# EAGLE design hr20 (EAGLE 6.6.0)
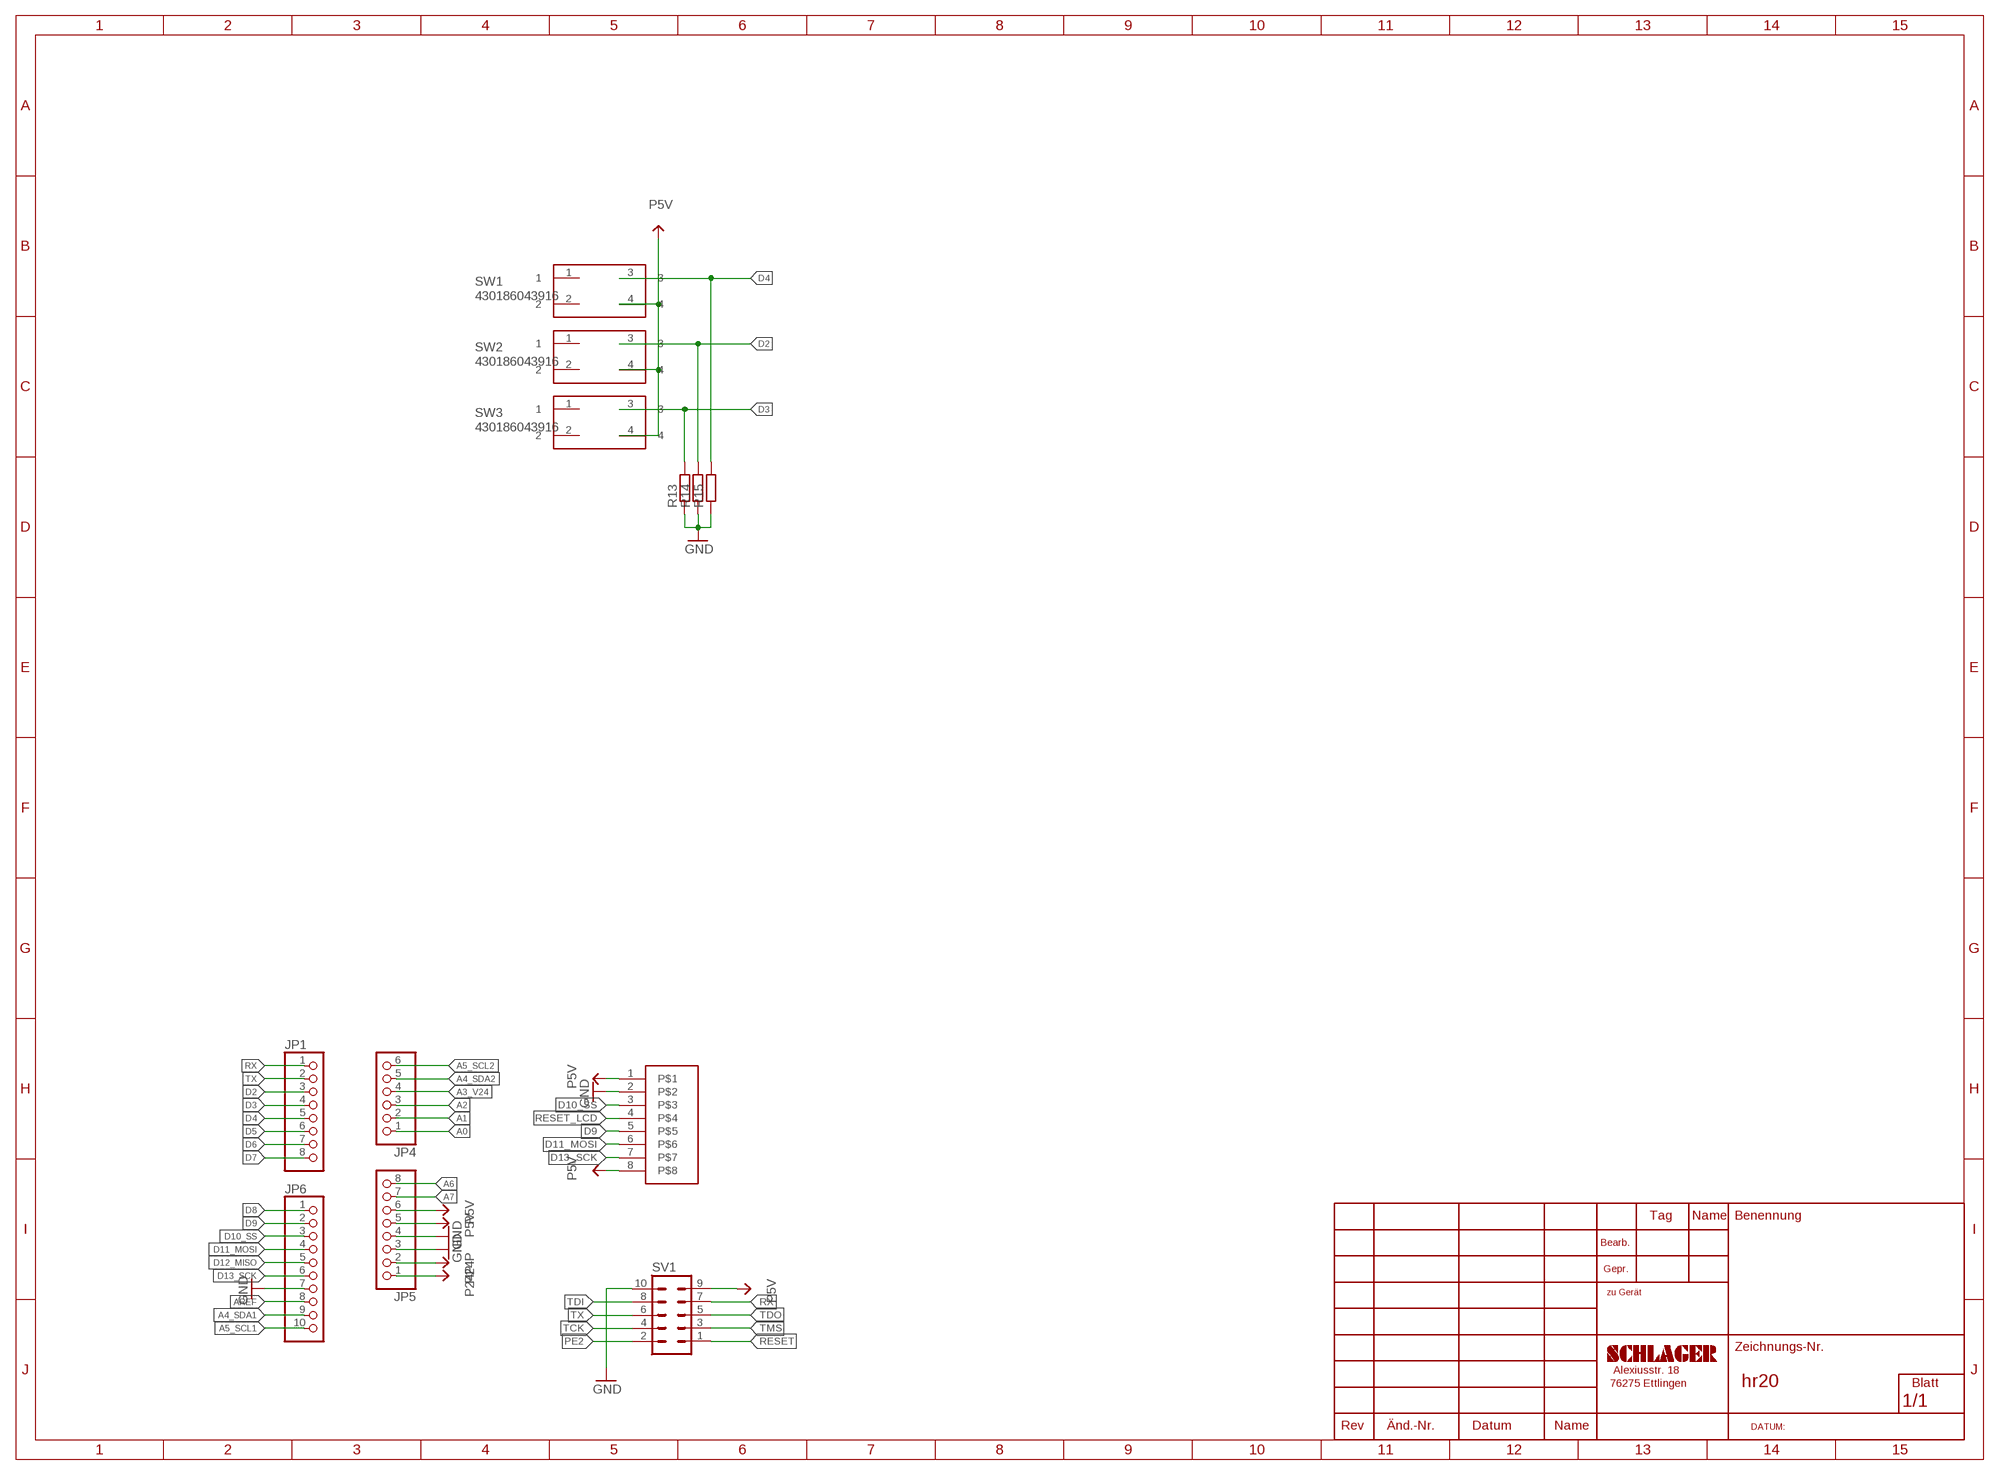
[diagram p0: schematic, sheet 1]

## Parts
JP1  PINHD-1X8  [1X08]
JP4  PINHD-1X6  [1X06]
JP5  PINHD-1X8  [1X08]
JP6  PINHD-1X10  [1X10]
R13  R-EU_0207/10  [0207/10]
R14  R-EU_0207/10  [0207/10]
R15  R-EU_0207/10  [0207/10]
SV1  ML10  [ML10]
SW1  430186043916  [430186043916]
SW2  430186043916  [430186043916]
SW3  430186043916  [430186043916]
U$2  1.44-128X128  [1.44-128X128]

## Nets
A0: JP4.1
A1: JP4.2
A2: JP4.3
A3_V24: JP4.4
A4_SDA1: JP6.9
A4_SDA2: JP4.5
A5_SCL1: JP6.10
A5_SCL2: JP4.6
A6: JP5.8
A7: JP5.7
AREF: JP6.8
D2: JP1.3 R14.2 SW2.3
D3: JP1.4 R13.2 SW3.3
D4: JP1.5 R15.2 SW1.3
D5: JP1.6
D6: JP1.7
D7: JP1.8
D8: JP6.1
D9: JP6.2 U$2.5
D10_SS: JP6.3 U$2.3
D11_MOSI: JP6.4 U$2.6
D12_MISO: JP6.5
D13_SCK: JP6.6 U$2.7
GND: JP5.3 JP5.4 JP6.7 R13.1 R14.1 R15.1 SV1.10 U$2.2
P5V: JP5.5 JP5.6 SV1.9 SW1.4 SW2.4 SW3.4 U$2.1 U$2.8
P24P: JP5.1 JP5.2
PE2: SV1.2
RESET: SV1.1
RESET_LCD: U$2.4
RX: JP1.1 SV1.7
TCK: SV1.4
TDI: SV1.8
TDO: SV1.5
TMS: SV1.3
TX: JP1.2 SV1.6
Unconnected: SW1.1 SW1.2 SW2.1 SW2.2 SW3.1 SW3.2

## Library data of the parts
JP1 JP5 = pinhead:PINHD-1X8: PIN HEADER
JP4 = pinhead:PINHD-1X6: PIN HEADER
JP6 = pinhead:PINHD-1X10: PIN HEADER
R13-R15 = schlager_passiv:R-EU_: RESISTOR, European symbol
SV1 = X_Pfostenstecker:ML10: HARTING; OC_FARNELL: unknown; OC_NEWARK: unknown
SW1-SW3 = Wuerth_Elektronik_Switch:430186043916: WS-TST-6x6 mm THT Tact Switch,4 pins
U$2 = schlager_modules:1.44-128X128

## Net classes
4 USBpair: width 0.254 mm, drill 0.406 mm, clearance 0.508 mm

## Board
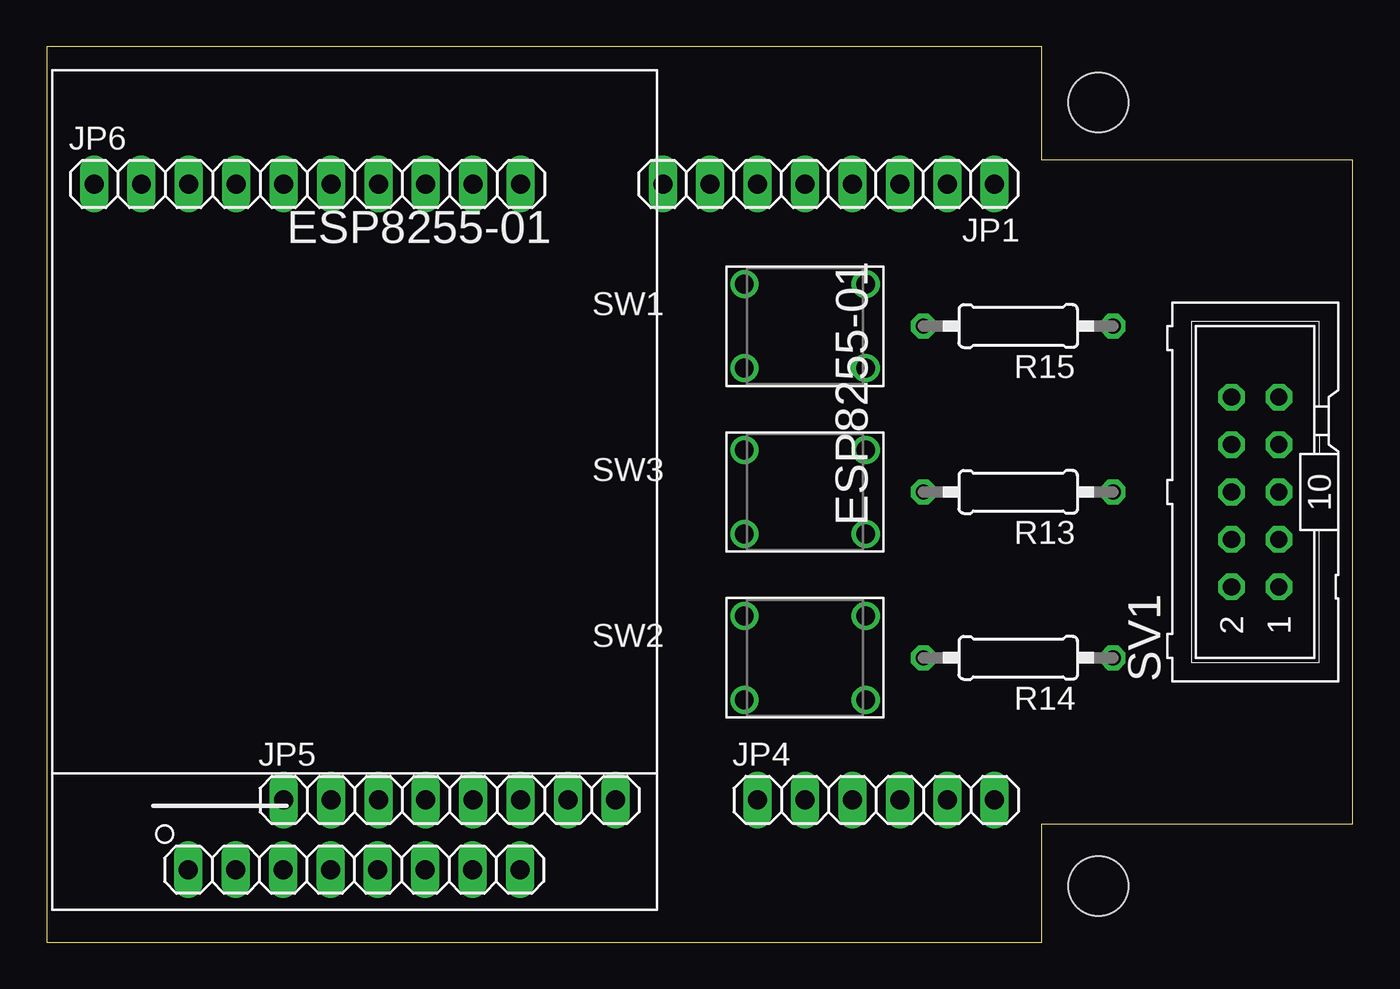
[diagram p1: board, top side]
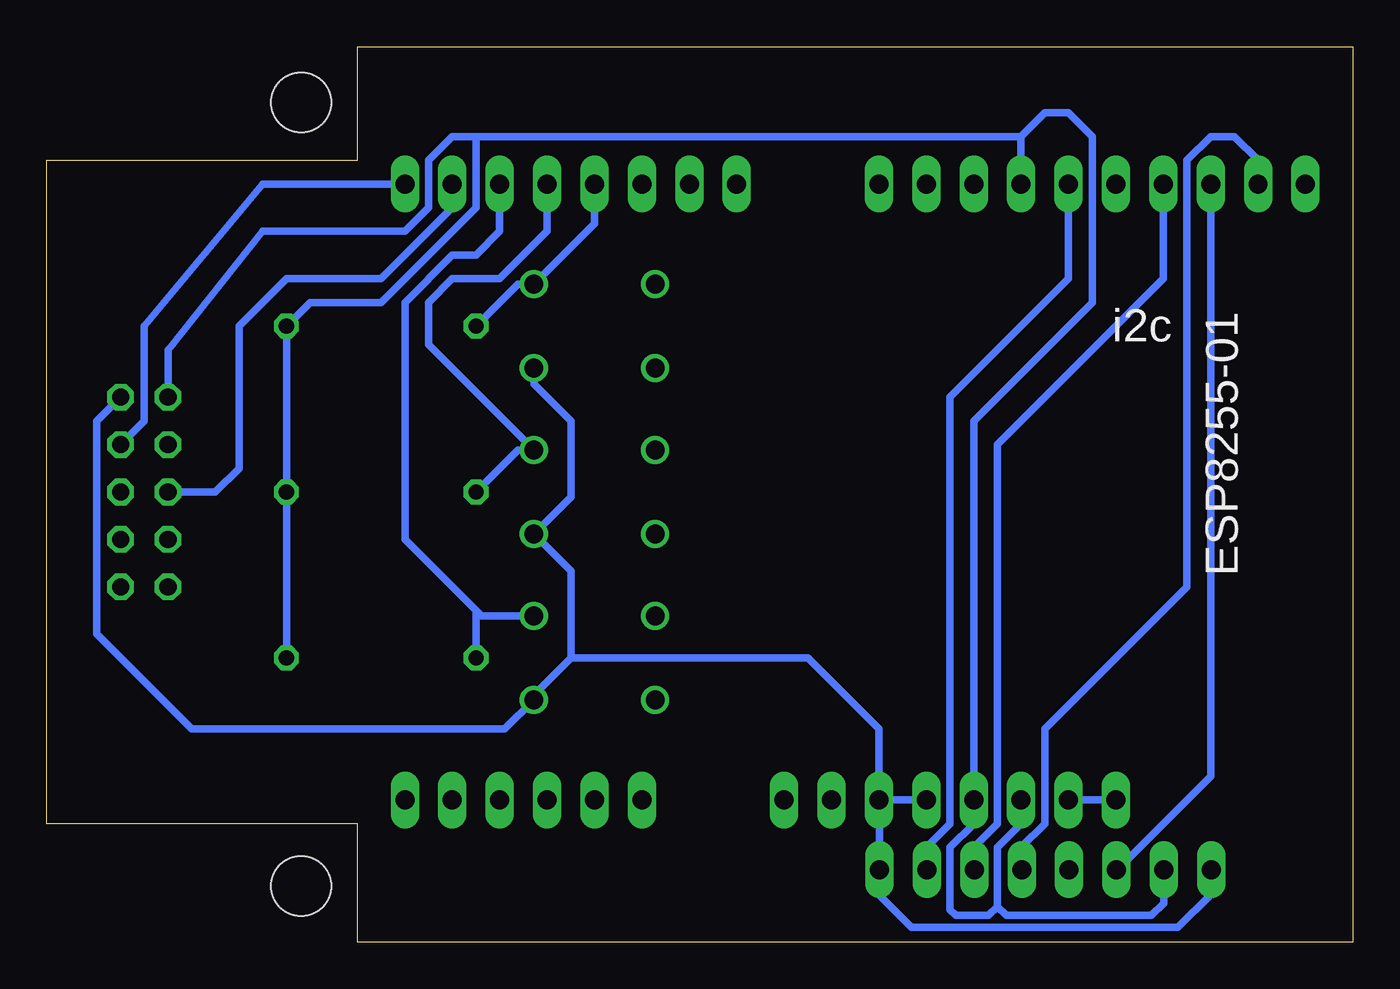
[diagram p2: board, bottom side, seen from below]

Size 70 x 48 mm. Coordinates in mm from the lower left corner, seen from the top.
Outline: 0,0 53.34,0 53.34,6.35 70,6.35 70,41.91 53.34,41.91 53.34,48 0,48 0,0
Copper layers (1*16): Top 0.035mm / dielectric 1.5mm / Bottom 0.035mm
Design rules "ITEADstudio_DRC": minimum track width 6mil, minimum drill 12mil, track to track 6mil, track to pad 6mil, pad to pad 6mil, via to via 6mil, smd to smd 0mil, copper to edge 10mil, drill to drill 10mil, minimum pad ring 10mil, minimum via ring 6mil, stop-mask expansion 2mil, vias tented up to drill 100mil, thermal gap 10mil
Holes 3.2 mm at 56.36,45 56.36,3

### Footprints (pad centres in the part's own frame; a part is rotated, then mirrored left to right if it is on the bottom)
1X08 = drill 1.016 long: 1 -8.89,0; 2 -6.35,0; 3 -3.81,0; 4 -1.27,0; 5 1.27,0; 6 3.81,0; 7 6.35,0; 8 8.89,0
1X06 = drill 1.016 long: 1 -6.35,0; 2 -3.81,0; 3 -1.27,0; 4 1.27,0; 5 3.81,0; 6 6.35,0
1X10 = drill 1.016 long: 1 -11.43,0; 2 -8.89,0; 3 -6.35,0; 4 -3.81,0; 5 -1.27,0; 6 1.27,0; 7 3.81,0; 8 6.35,0; 9 8.89,0; 10 11.43,0
0207/10 = drill 0.813 octagon: 1 -5.08,0; 2 5.08,0
ML10 = drill 0.914 octagon: 1 -5.08,-1.27; 2 -5.08,1.27; 3 -2.54,-1.27; 4 -2.54,1.27; 5 0,-1.27; 6 0,1.27; 7 2.54,-1.27; 8 2.54,1.27; 9 5.08,-1.27; 10 5.08,1.27
430186043916 = drill 1: 1 -3.25,2.25; 2 -3.25,-2.25; 3 3.25,2.25; 4 3.25,-2.25
1.44-128X128 = drill 1.016 long: 1 7.27,2.14; 2 9.81,2.14; 3 12.35,2.14; 4 14.89,2.14; 5 17.43,2.14; 6 19.97,2.14; 7 22.51,2.14; 8 25.05,2.14

### Placement (x,y rotation side)
JP1  41.91,40.64 180 top
JP4  44.45,7.62 0 top
JP5  21.59,7.62 0 top
JP6  13.97,40.64 0 top
R13  52.07,24.13 180 top
R14  52.07,15.24 180 top
R15  52.07,33.02 180 top
SV1  64.77,24.13 90 top
SW1  40.64,33.02 0 top
SW2  40.64,15.24 0 top
SW3  40.64,24.13 0 top
U$2  0.32,1.75 0 top

### Tracks (layer width: path | path; a pad name or v marks a point on that pad's centre or on a via)
D2
  Bottom 0.406: JP1.3 45.72,38.1 46.99,36.83 48.26,36.83 50.8,34.29 50.8,21.59 46.99,17.78 | 46.99,17.78 R14.2 | SW2.3 46.7,17.49 46.99,17.78
D3
  Bottom 0.406: JP1.4 43.18,38.1 45.72,35.56 48.26,35.56 49.53,34.29 49.53,32.02 SW3.3 44.74,26.38 R13.2
D4
  Bottom 0.406: JP1.5 40.64,38.52 SW1.3 44.74,35.27 R15.2
D9
  Bottom 0.406: JP6.2 5.08,41.91 6.35,43.18 7.62,43.18 8.89,41.91 8.89,19.05 16.51,11.43 16.51,6.35 17.78,5.08 17.78,3.92 U$2.5
D10_SS
  Bottom 0.406: U$2.3 12.35,4.16 7.62,8.89 JP6.3
D11_MOSI
  Bottom 0.406: JP6.4 10.16,35.56 19.05,26.67 19.05,6.35 20.32,5.08 20.32,3.92 U$2.6
D13_SCK
  Bottom 0.406: JP6.6 15.24,35.56 21.59,29.21 21.59,6.35 22.86,5.08 22.86,3.92 U$2.7
GND
  Bottom 0.406: R14.1 R13.1 R15.1 55.88,34.29 52.07,34.29 46.99,39.37 46.99,43.18 | 17.78,43.18 16.51,44.45 15.24,44.45 13.97,43.18 13.97,34.29 20.32,27.94 JP5.4 20.32,6.35 21.59,5.08 21.59,1.75 21.27,1.43 19.53,1.43 19.05,1.91 | 17.78,43.18 JP6.7 | SV1.10 63.5,31.75 58.42,38.1 50.8,38.1 49.53,39.37 49.53,41.91 48.26,43.18 46.99,43.18 | 46.99,43.18 17.78,43.18 | 19.05,1.91 19.05,5.08 17.78,6.35 JP5.3 | U$2.2 10.13,2.1 10.79,1.43 18.57,1.43 19.05,1.91
P5V
  Bottom 0.406: SW1.4 43.89,29.92 41.91,27.94 41.91,23.86 SW3.4 41.91,19.9 41.91,15.24 | 41.91,15.24 43.89,13.26 SW2.4 45.45,11.43 62.23,11.43 67.31,16.51 67.31,27.94 SV1.9 | 41.91,15.24 29.21,15.24 25.4,11.43 JP5.6 | JP5.6 25.37,7.59 U$2.8 25.4,3.85 25.4,2.54 23.65,0.79 9.37,0.79 7.59,2.57 U$2.1 | JP5.5 JP5.6
P24P
  Bottom 0.406: JP5.1 JP5.2
RX
  Bottom 0.406: JP1.1 58.42,40.64 64.77,33.02 64.77,27.94 SV1.7
TX
  Bottom 0.406: SV1.6 60.96,24.13 59.69,25.4 59.69,33.02 57.15,35.56 52.07,35.56 48.26,39.37 JP1.2

### Text on the board
tNames: ESP8255-01 | ESP8255-01
bNames: ESP8255-01 | i2c